# Altium schematic sheet SCH_HallcurrentLA25p.SchDoc
size A; DocumentNumber: 2; SheetNumber: 2; SheetTotal: 4
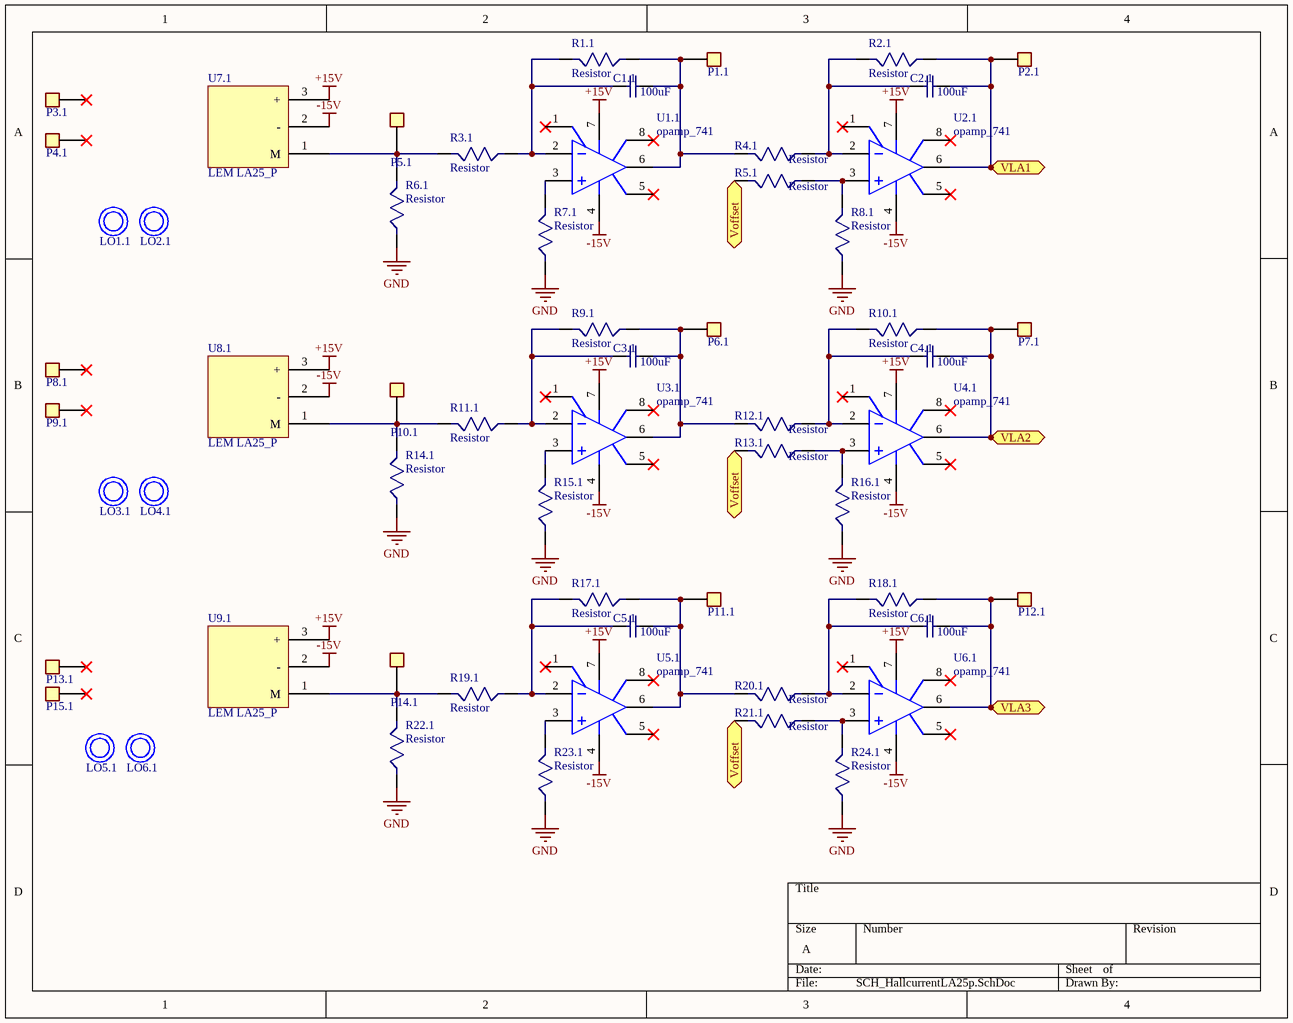
[diagram p0: SCH_HallcurrentLA25p.SchDoc]

## Parts
C1.1  100uF  [CAPC0805]
C2.1  100uF  [CAPC0805]
C3.1  100uF  [CAPC0805]
C4.1  100uF  [CAPC0805]
C5.1  100uF  [CAPC0805]
C6.1  100uF  [CAPC0805]
LO1.1  LO KHOAN  [Lo Khoang - 6mm]  (value not drawn)
LO2.1  LO KHOAN  [Lo Khoang - 6mm]  (value not drawn)
LO3.1  LO KHOAN  [Lo Khoang - 6mm]  (value not drawn)
LO4.1  LO KHOAN  [Lo Khoang - 6mm]  (value not drawn)
LO5.1  LO KHOAN  [Lo Khoang - 6mm]  (value not drawn)
LO6.1  LO KHOAN  [Lo Khoang - 6mm]  (value not drawn)
P1.1  testpin  [Tp_blue_1p]  (value not drawn)
P2.1  testpin  [Tp_blue_1p]  (value not drawn)
P3.1  Terminal on PCB  [Terminal M5]  (value not drawn)
P4.1  Terminal on PCB  [Terminal M5]  (value not drawn)
P5.1  testpin  [Tp_blue_1p]  (value not drawn)
P6.1  testpin  [Tp_blue_1p]  (value not drawn)
P7.1  testpin  [Tp_blue_1p]  (value not drawn)
P8.1  Terminal on PCB  [Terminal M5]  (value not drawn)
P9.1  Terminal on PCB  [Terminal M5]  (value not drawn)
P10.1  testpin  [Tp_blue_1p]  (value not drawn)
P11.1  testpin  [Tp_blue_1p]  (value not drawn)
P12.1  testpin  [Tp_blue_1p]  (value not drawn)
P13.1  Terminal on PCB  [Terminal M5]  (value not drawn)
P14.1  testpin  [Tp_blue_1p]  (value not drawn)
P15.1  Terminal on PCB  [Terminal M5]  (value not drawn)
R1.1  Resistor  [RESC0805]
R2.1  Resistor  [RESC0805]
R3.1  Resistor  [RESC0805]
R4.1  Resistor  [RESC0805]
R5.1  Resistor  [RESC0805]
R6.1  Resistor  [RESC0805]
R7.1  Resistor  [RESC0805]
R8.1  Resistor  [RESC0805]
R9.1  Resistor  [RESC0805]
R10.1  Resistor  [RESC0805]
R11.1  Resistor  [RESC0805]
R12.1  Resistor  [RESC0805]
R13.1  Resistor  [RESC0805]
R14.1  Resistor  [RESC0805]
R15.1  Resistor  [RESC0805]
R16.1  Resistor  [RESC0805]
R17.1  Resistor  [RESC0805]
R18.1  Resistor  [RESC0805]
R19.1  Resistor  [RESC0805]
R20.1  Resistor  [RESC0805]
R21.1  Resistor  [RESC0805]
R22.1  Resistor  [RESC0805]
R23.1  Resistor  [RESC0805]
R24.1  Resistor  [RESC0805]
U1.1  opamp_741  [SOIC-8_dan]
U2.1  opamp_741  [SOIC-8_dan]
U3.1  opamp_741  [SOIC-8_dan]
U4.1  opamp_741  [SOIC-8_dan]
U5.1  opamp_741  [SOIC-8_dan]
U6.1  opamp_741  [SOIC-8_dan]
U7.1  LEM LA25_P  [LEM LA25_P]
U8.1  LEM LA25_P  [LEM LA25_P]
U9.1  LEM LA25_P  [LEM LA25_P]

## Ports
VLA1, VLA2, VLA3, Voffset

## Nets
+15V: U1.1.7(V+) U2.1.7(V+) U3.1.7(V+) U4.1.7(V+) U5.1.7(V+) U6.1.7(V+) U7.1.3(+) U8.1.3(+) U9.1.3(+)
-15V: U1.1.4(V-) U2.1.4(V-) U3.1.4(V-) U4.1.4(V-) U5.1.4(V-) U6.1.4(V-) U7.1.2(-) U8.1.2(-) U9.1.2(-)
GND: R6.1.1 R7.1.1 R8.1.1 R14.1.1 R15.1.1 R16.1.1 R22.1.1 R23.1.1 R24.1.1
VLA1: C2.1.2 P2.1.1 R2.1.1 U2.1.6(OUT) ; port VLA1
VLA2: C4.1.2 P7.1.1 R10.1.1 U4.1.6(OUT) ; port VLA2
VLA3: C6.1.2 P12.1.1 R18.1.1 U6.1.6(OUT) ; port VLA3
Voffset: R5.1.2 R13.1.2 R21.1.2 ; port Voffset
NetC1.1_1: C1.1.1 R1.1.2 R3.1.1 U1.1.2(IN-)
NetC1.1_2: C1.1.2 P1.1.1 R1.1.1 R4.1.2 U1.1.6(OUT)
NetC2.1_1: C2.1.1 R2.1.2 R4.1.1 U2.1.2(IN-)
NetC3.1_1: C3.1.1 R9.1.2 R11.1.1 U3.1.2(IN-)
NetC3.1_2: C3.1.2 P6.1.1 R9.1.1 R12.1.2 U3.1.6(OUT)
NetC4.1_1: C4.1.1 R10.1.2 R12.1.1 U4.1.2(IN-)
NetC5.1_1: C5.1.1 R17.1.2 R19.1.1 U5.1.2(IN-)
NetC5.1_2: C5.1.2 P11.1.1 R17.1.1 R20.1.2 U5.1.6(OUT)
NetC6.1_1: C6.1.1 R18.1.2 R20.1.1 U6.1.2(IN-)
NetP5.1_1: P5.1.1 R3.1.2 R6.1.2 U7.1.1(M)
NetP10.1_1: P10.1.1 R11.1.2 R14.1.2 U8.1.1(M)
NetP14.1_1: P14.1.1 R19.1.2 R22.1.2 U9.1.1(M)
NetR5.1_1: R5.1.1 R8.1.2 U2.1.3(IN+)
NetR7.1_2: R7.1.2 U1.1.3(IN+)
NetR13.1_1: R13.1.1 R16.1.2 U4.1.3(IN+)
NetR15.1_2: R15.1.2 U3.1.3(IN+)
NetR21.1_1: R21.1.1 R24.1.2 U6.1.3(IN+)
NetR23.1_2: R23.1.2 U5.1.3(IN+)

Not connected (* = marked no-connect by the designer): P3.1 1*; P4.1 1*; P8.1 1*; P9.1 1*; P13.1 1*; P15.1 1*; U1.1 1(VOSTRIM)* 5(NC)* 8(VOSTRIM)*; U2.1 1(VOSTRIM)* 5(NC)* 8(VOSTRIM)*; U3.1 1(VOSTRIM)* 5(NC)* 8(VOSTRIM)*; U4.1 1(VOSTRIM)* 5(NC)* 8(VOSTRIM)*; U5.1 1(VOSTRIM)* 5(NC)* 8(VOSTRIM)*; U6.1 1(VOSTRIM)* 5(NC)* 8(VOSTRIM)*

## Library data of the parts
C1.1 C2.1 C3.1 C4.1 C5.1 C6.1 = capacitor_non_polar: capacitor non polar
U1.1 U2.1 U3.1 U4.1 U5.1 U6.1 = opamp 741